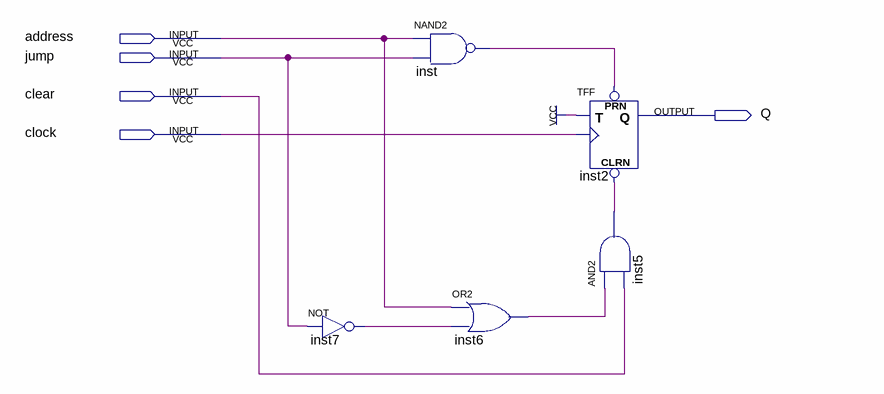
[diagram p0: schematic sheet]
// Quartus schematic jump.bdf as structural Verilog: 5 symbols, 5 pins
module jump (
  input  address,
  input  jump,
  input  clear,
  input  clock,
  output Q
);

  wire inst5_out, inst6_out, inst7_out, inst_out;

  not inst7 (inst7_out, jump);
  nand inst (inst_out, address, jump);
  or inst6 (inst6_out, address, inst7_out);
  TFF inst2 (.PRN(inst_out), .CLRN(inst5_out), .T(1'b1), .CLK(clock), .Q(Q));
  and inst5 (inst5_out, inst6_out, clear);
endmodule
